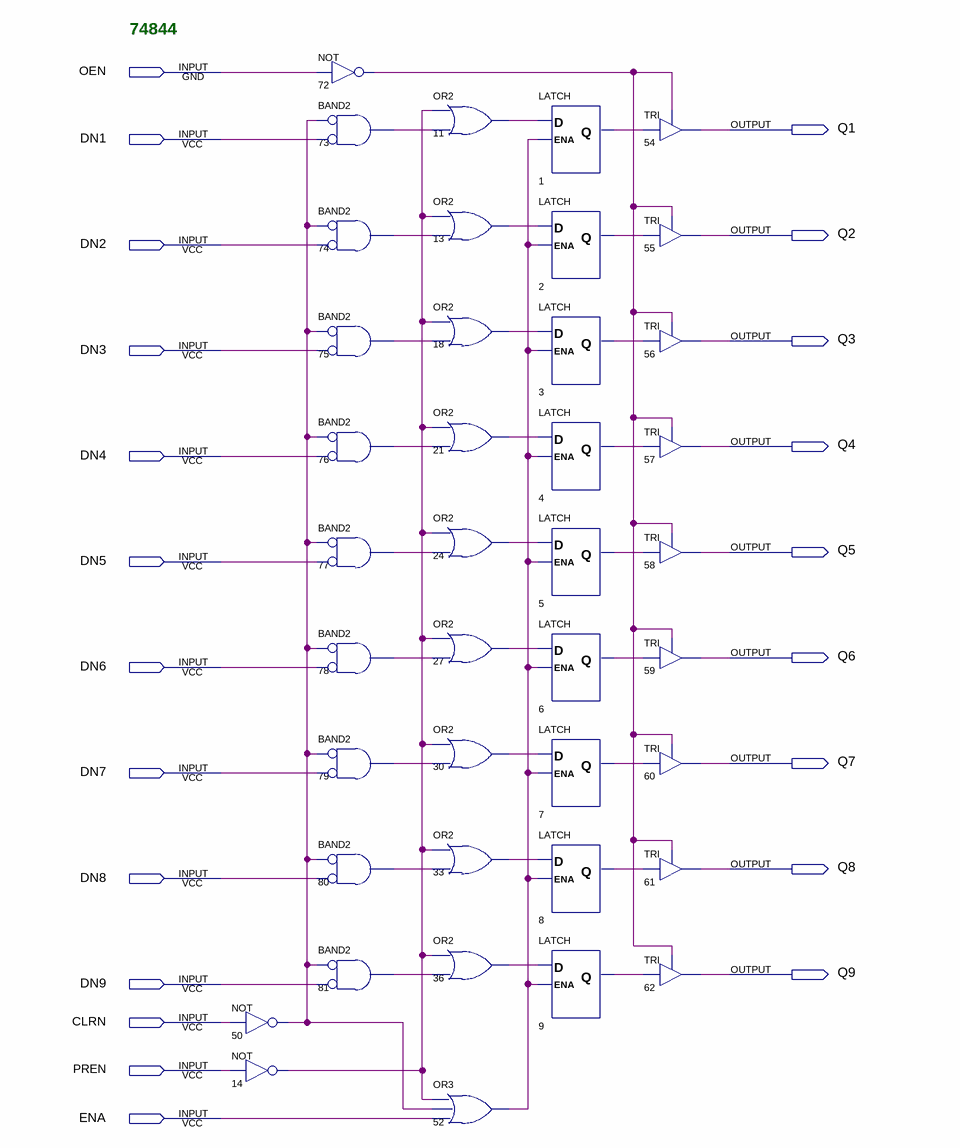
[diagram p0: schematic sheet]
// Quartus schematic 74844.bdf as structural Verilog: 40 symbols, 22 pins
module \74844  (
  input  OEN,
  input  DN1,
  input  DN2,
  input  DN3,
  input  DN4,
  input  DN5,
  input  DN6,
  input  DN7,
  input  DN8,
  input  DN9,
  input  CLRN,
  input  PREN,
  input  ENA,
  output Q1,
  output Q2,
  output Q3,
  output Q4,
  output Q5,
  output Q6,
  output Q7,
  output Q8,
  output Q9
);

  wire n1_q, n2_q, n3_q, n4_q, n5_q, n6_q, n7_q, n8_q, n9_q, n11_out, n13_out, n14_out, n18_out, n21_out,
       n24_out, n27_out, n30_out, n33_out, n36_out, n50_out, n52_out, n72_out, n73_out, n74_out, n75_out,
       n76_out, n77_out, n78_out, n79_out, n80_out, n81_out;

  not u_50 (n50_out, CLRN);
  not u_14 (n14_out, PREN);
  not u_72 (n72_out, OEN);
  and u_73 (n73_out, ~n50_out, ~DN1);  // BAND2
  and u_74 (n74_out, ~n50_out, ~DN2);  // BAND2
  and u_75 (n75_out, ~n50_out, ~DN3);  // BAND2
  and u_76 (n76_out, ~n50_out, ~DN4);  // BAND2
  and u_77 (n77_out, ~n50_out, ~DN5);  // BAND2
  and u_78 (n78_out, ~n50_out, ~DN6);  // BAND2
  and u_79 (n79_out, ~n50_out, ~DN7);  // BAND2
  and u_80 (n80_out, ~n50_out, ~DN8);  // BAND2
  and u_81 (n81_out, ~n50_out, ~DN9);  // BAND2
  or u_11 (n11_out, n14_out, n73_out);
  or u_13 (n13_out, n14_out, n74_out);
  or u_18 (n18_out, n14_out, n75_out);
  or u_21 (n21_out, n14_out, n76_out);
  or u_24 (n24_out, n14_out, n77_out);
  or u_27 (n27_out, n14_out, n78_out);
  or u_30 (n30_out, n14_out, n79_out);
  or u_33 (n33_out, n14_out, n80_out);
  or u_36 (n36_out, n14_out, n81_out);
  or u_52 (n52_out, n14_out, n50_out, ENA);
  LATCH u_1 (.D(n11_out), .ENA(n52_out), .Q(n1_q));
  LATCH u_2 (.D(n13_out), .ENA(n52_out), .Q(n2_q));
  LATCH u_3 (.D(n18_out), .ENA(n52_out), .Q(n3_q));
  LATCH u_4 (.D(n21_out), .ENA(n52_out), .Q(n4_q));
  LATCH u_5 (.D(n24_out), .ENA(n52_out), .Q(n5_q));
  LATCH u_6 (.D(n27_out), .ENA(n52_out), .Q(n6_q));
  LATCH u_7 (.D(n30_out), .ENA(n52_out), .Q(n7_q));
  LATCH u_8 (.D(n33_out), .ENA(n52_out), .Q(n8_q));
  LATCH u_9 (.D(n36_out), .ENA(n52_out), .Q(n9_q));
  TRI u_54 (.IN(n1_q), .OE(n72_out), .OUT(Q1));
  TRI u_55 (.IN(n2_q), .OE(n72_out), .OUT(Q2));
  TRI u_56 (.IN(n3_q), .OE(n72_out), .OUT(Q3));
  TRI u_57 (.IN(n4_q), .OE(n72_out), .OUT(Q4));
  TRI u_58 (.IN(n5_q), .OE(n72_out), .OUT(Q5));
  TRI u_59 (.IN(n6_q), .OE(n72_out), .OUT(Q6));
  TRI u_60 (.IN(n7_q), .OE(n72_out), .OUT(Q7));
  TRI u_61 (.IN(n8_q), .OE(n72_out), .OUT(Q8));
  TRI u_62 (.IN(n9_q), .OE(n72_out), .OUT(Q9));

  // Notes on the sheet:
  //   74844
endmodule
